# Altium schematic sheet RGBReceiverRF.SchDoc
size A3; SheetNumber: 2; SheetTotal: 9
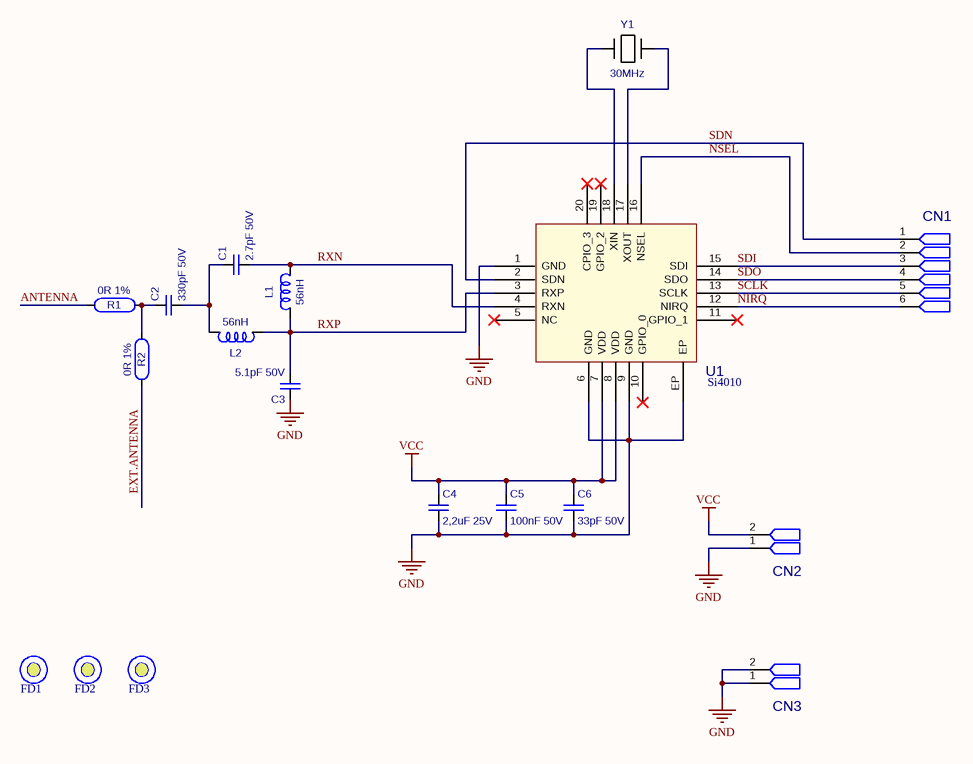
[diagram p0: RGBReceiverRF.SchDoc]

## Parts
C1  2.7pF 50V  [C0805]
C2  value 330pF 50V  [C0805]  (hidden comment: 270pF 50V)
C3  5.1pF 50V  [C0805]
C4  2,2uF 25V  [C1206]
C5  100nF 50V  [C0805]
C6  33pF 50V  [C0805]
CN1  CON BARRA 1x6 180 MACHO PTH  [BARRA6PM180]  (value not drawn)
CN2  CON BARRA 1x2 180 MACHO PTH  [BARRA2PM180]  (value not drawn)
CN3  CON BARRA 1x2 180 MACHO PTH  [BARRA2PM180]  (value not drawn)
FD1  Fiducial  [Fiducial]  (value not drawn)
FD2  Fiducial  [Fiducial]  (value not drawn)
FD3  Fiducial  [Fiducial]  (value not drawn)
L1  56nH  [I0805]
L2  56nH  [I0805]
R1  0R 1%  [R0805]
R2  0R 1%  [R0805]
U1  value Si4010  [QFN20 3X3]  (hidden comment: CI Si4355 QFN20)
Y1  30MHz  [ABLS SMD]

## Nets
GND: C3.1 C4.2 C5.2 C6.2 CN2.1 CN3.1 CN3.2 U1.1(GND) U1.6(GND) U1.9(GND) U1.EP
VCC: C4.1 C5.1 C6.1 CN2.2 U1.7(VDD) U1.8(VDD)
ANTENNA: R1.1
EXT.ANTENNA: R2.1
NIRQ: CN1.6 U1.12(NIRQ)
NSEL: CN1.2 U1.16(NSEL)
RXN: C1.2 L1.2 U1.4(RXN)
RXP: C3.2 L1.1 L2.1 U1.3(RXP)
SCLK: CN1.5 U1.13(SCLK)
SDI: CN1.3 U1.15(SDI)
SDN: CN1.1 U1.2(SDN)
SDO: CN1.4 U1.14(SDO)
NetC1_1: C1.1 C2.2 L2.2
NetC2_1: C2.1 R1.2 R2.2
NetU1_17: U1.17(XOUT) Y1.2
NetU1_18: U1.18(XIN) Y1.1

Not connected (* = marked no-connect by the designer): U1 5(NC)* 10(GPIO_0)* 11(GPIO_1)* 19(GPIO_2)* 20(CPIO_3)*

## Notes on the sheet
- Aplicação:
- Cod. SC:
- PCI:
- Documento: EE-
- Rev. PCI:
- Rev.EE:
- Data:
- Cod. PCI:
- Projetista:
- Aprovado por:
- Pg:
- /

## Library data of the parts
C1 = CC 2.7pF 50V 0805: Part Number: VJ0805A2R7CXAPW1BC; REFERENCIA: ???; ENCAPSULAMENTO: C0805; ModifyDate: ???; Value: 2.7pF 50V
C2 = CC 270pF 50V 0805: Part Number: 08055A271JAT2A; REFERENCIA: ????; ENCAPSULAMENTO: C0805; ModifyDate: ???
C3 = CC 5.1pF 50V 0805: Part Number: 08055A5R1CAT2A; REFERENCIA: ???; ENCAPSULAMENTO: C0805; ModifyDate: ???; Value: 5.1pF 50V
C4 = CC 2,2uF 25V 1206: REFERENCIA: 003.10.002; ENCAPSULAMENTO: C1206; ModifyDate: 05/27/2015 14:07:26; Value: 2,2uF 25V
C5 = CC 100nF 50V 0805: REFERENCIA: 003.05.002; ENCAPSULAMENTO: C0805; ModifyDate: 05/27/2015 14:07:26; Value: 100nF 50V
C6 = CC 33pF 50V 0805: REFERENCIA: 003.05.010; ENCAPSULAMENTO: C0805; ModifyDate: 05/27/2015 14:07:26; Value: 33pF 50V
CN1 = CON BARRA 1x6 180 MACHO PTH: Barra de pinos simples 1x6 180g. 2,54mm; Part Number: {Part Number}; Value: BARRA6PM180; REFERENCIA: 052.01.014; ENCAPSULAMENTO: PTH; ModifyDate: 05/27/2015 14:07:26
CN2 CN3 = CON BARRA 1x2 180 MACHO PTH: Barra de pinos simples 1x2 180g. 2,54mm; Part Number: {Part Number}; Value: BARRA2PM180; REFERENCIA: 052.01.014; ENCAPSULAMENTO: PTH; ModifyDate: 05/27/2015 14:07:26
L1 L2 = IND 56nH 0805 SMD: Part Number: IMC0805ER56NJ01; REFERENCIA: ???; ENCAPSULAMENTO: *; ModifyDate: ???; Value: 56nH
R1 R2 = RES 0R 1% 0805: Part Number: {Part Number}; REFERENCIA: 002.05.001; ENCAPSULAMENTO: R0805; ModifyDate: 05/27/2015 14:07:26; Value: 0R 1%
U1 = CI Si4355 QFN20: Part Number: Si4355-B1A-FM; REFERENCIA: -; ENCAPSULAMENTO: QFN20; ModifyDate: -
Y1 = XTAL 30MHZ ABLS-SMC: Part Number: ABLS-30.000MHZ-B4-F-T; REFERENCIA: ?????; ENCAPSULAMENTO: ABLS-SMC; ModifyDate: 05/27/2015 14:07:26; Value: 30MHz